# Altium schematic sheet GPS_NEOM8M.SchDoc
size A4; SheetNumber: 2; SheetTotal: 3
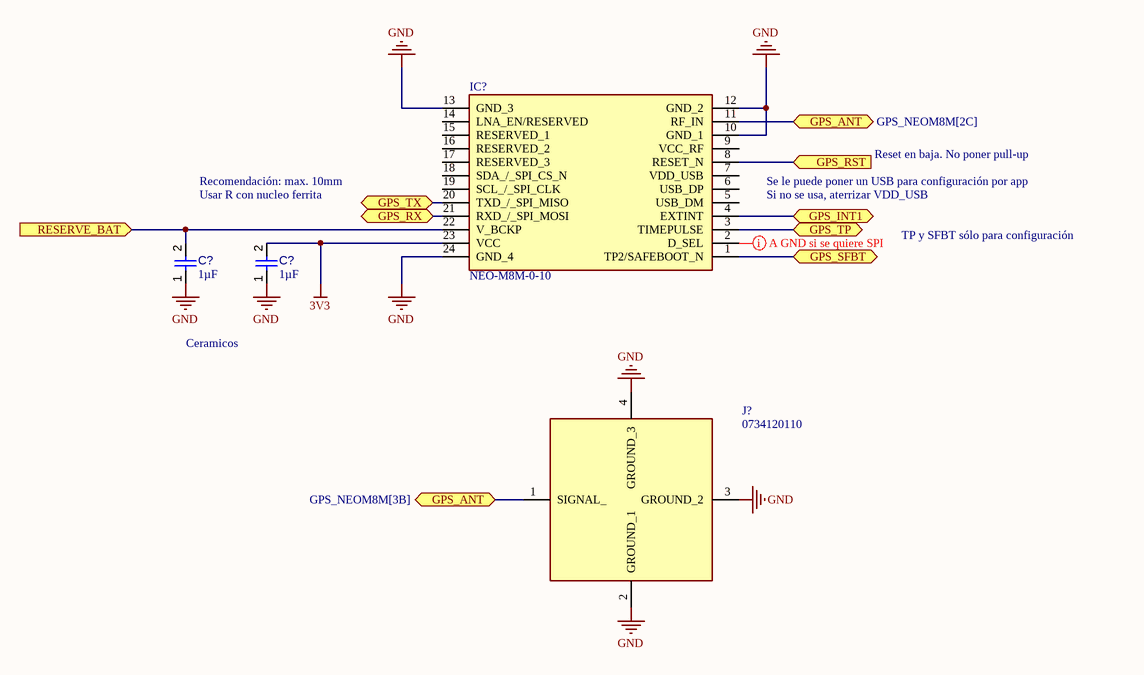
[diagram p0: GPS_NEOM8M.SchDoc]

## Parts
(Parts that share a designator on the sheet are numbered #1, #2 ... from top to bottom, then left to right.)
C?#1  value 1µF  [CAPC3216X180X20ML20]  (hidden comment: Capacitor 1 uF +/- 10% 25 V 1206)
C?#2  value 1µF  [CAPC3216X180X20ML20]  (hidden comment: Capacitor 1 uF +/- 10% 25 V 1206)
IC?  NEO-M8M-0-10  [NEO-M8T]
J?  0734120110  [0734120110]

## Ports
GPS_ANT (bidir, see GPS_NEOM8M[2C]), GPS_ANT (bidir, see GPS_NEOM8M[3B]), GPS_INT1 (bidir), GPS_RST (in), GPS_RX (bidir), GPS_SFBT (bidir), GPS_TP (bidir), GPS_TX (bidir), RESERVE_BAT (in)

## Nets
3V3: C?#2.2 IC?.23(VCC)
GND: C?#1.1 C?#2.1 IC?.10(GND_1) IC?.12(GND_2) IC?.13(GND_3) IC?.24(GND_4) J?.2(GROUND_1) J?.3(GROUND_2) J?.4(GROUND_3)
GPS_ANT: IC?.11(RF_IN) J?.1(SIGNAL_) ; port GPS_ANT
GPS_INT1: IC?.4(EXTINT) ; port GPS_INT1
GPS_RST: IC?.8(RESET_N) ; port GPS_RST
GPS_RX: IC?.21(RXD_/_SPI_MOSI) ; port GPS_RX
GPS_SFBT: IC?.1(TP2/SAFEBOOT_N) ; port GPS_SFBT
GPS_TP: IC?.3(TIMEPULSE) ; port GPS_TP
GPS_TX: IC?.20(TXD_/_SPI_MISO) ; port GPS_TX
RESERVE_BAT: C?#1.2 IC?.22(V_BCKP) ; port RESERVE_BAT

Not connected (* = marked no-connect by the designer): IC? 2(D_SEL) 5(USB_DM) 6(USB_DP) 7(VDD_USB) 9(VCC_RF) 14(LNA_EN/RESERVED) 15(RESERVED_1) 16(RESERVED_2) 17(RESERVED_3) 18(SDA_/_SPI_CS_N) 19(SCL_/_SPI_CLK)

## Layout directives
mark named A GND si se quiere SPI: NetIC?_2

## Notes on the sheet
- Recomendación: max. 10mm
- Se le puede poner un USB para configuración por app
- Reset en baja. No poner pull-up
- Usar R con nucleo ferrita
- Si no se usa, aterrizar VDD_USB
- TP y SFBT sólo para configuración
- Ceramicos

## Library data of the parts
C?#1 C?#2 = CMP-001-00006-4: Chip Capacitor, 1 uF, +/- 10%, 25 V, 1206 (3216 Metric); Voltage Rating: 25V; Capacitor Type: Ceramic; RoHS Compliant: True; Pins: 2; Min Operating Temperature: -55°C; Mounting Technology: SM; Max Operating Temperature: 125°C; Tolerance: 10%; Case/Package: 1206
IC? = NEO-M8M-0-10: Integrated Circuit; Manufacturer_Name: U-Blox; Datasheet Link: https://www.u-blox.com/sites/default/files/NEO-M8-FW3_DataSheet_%28UBX-15031086%29.pdf; Manufacturer_Part_Number: NEO-M8M-0-10
J? = 0734120110: Connector; Manufacturer_Name: Molex; Datasheet Link: https://www.molex.com/pdm_docs/sd/734120110_sd.pdf; Height: 1.36mm; Manufacturer_Part_Number: 0734120110; Mouser Part Number: N/A; Mouser Price/Stock: https://www.mouser.co.uk/ProductDetail/Molex/0734120110?qs=PBcRNPEHKsq%2FACQpFpzyEA%3D%3D; Arrow Part Number: 0734120110; Arrow Price/Stock: https://www.arrow.com/en/products/0734120110/molex?region=europe